# Altium schematic sheet MC3_blocks.SchDoc
size Letter; Organization: Altium Limited; Address1: L3, 12a Rodborough Rd; Address2: Frenchs Forest; Address3: NSW; Address4: Australia 2086; DocumentNumber: D_2; SheetNumber: 2; SheetTotal: 21
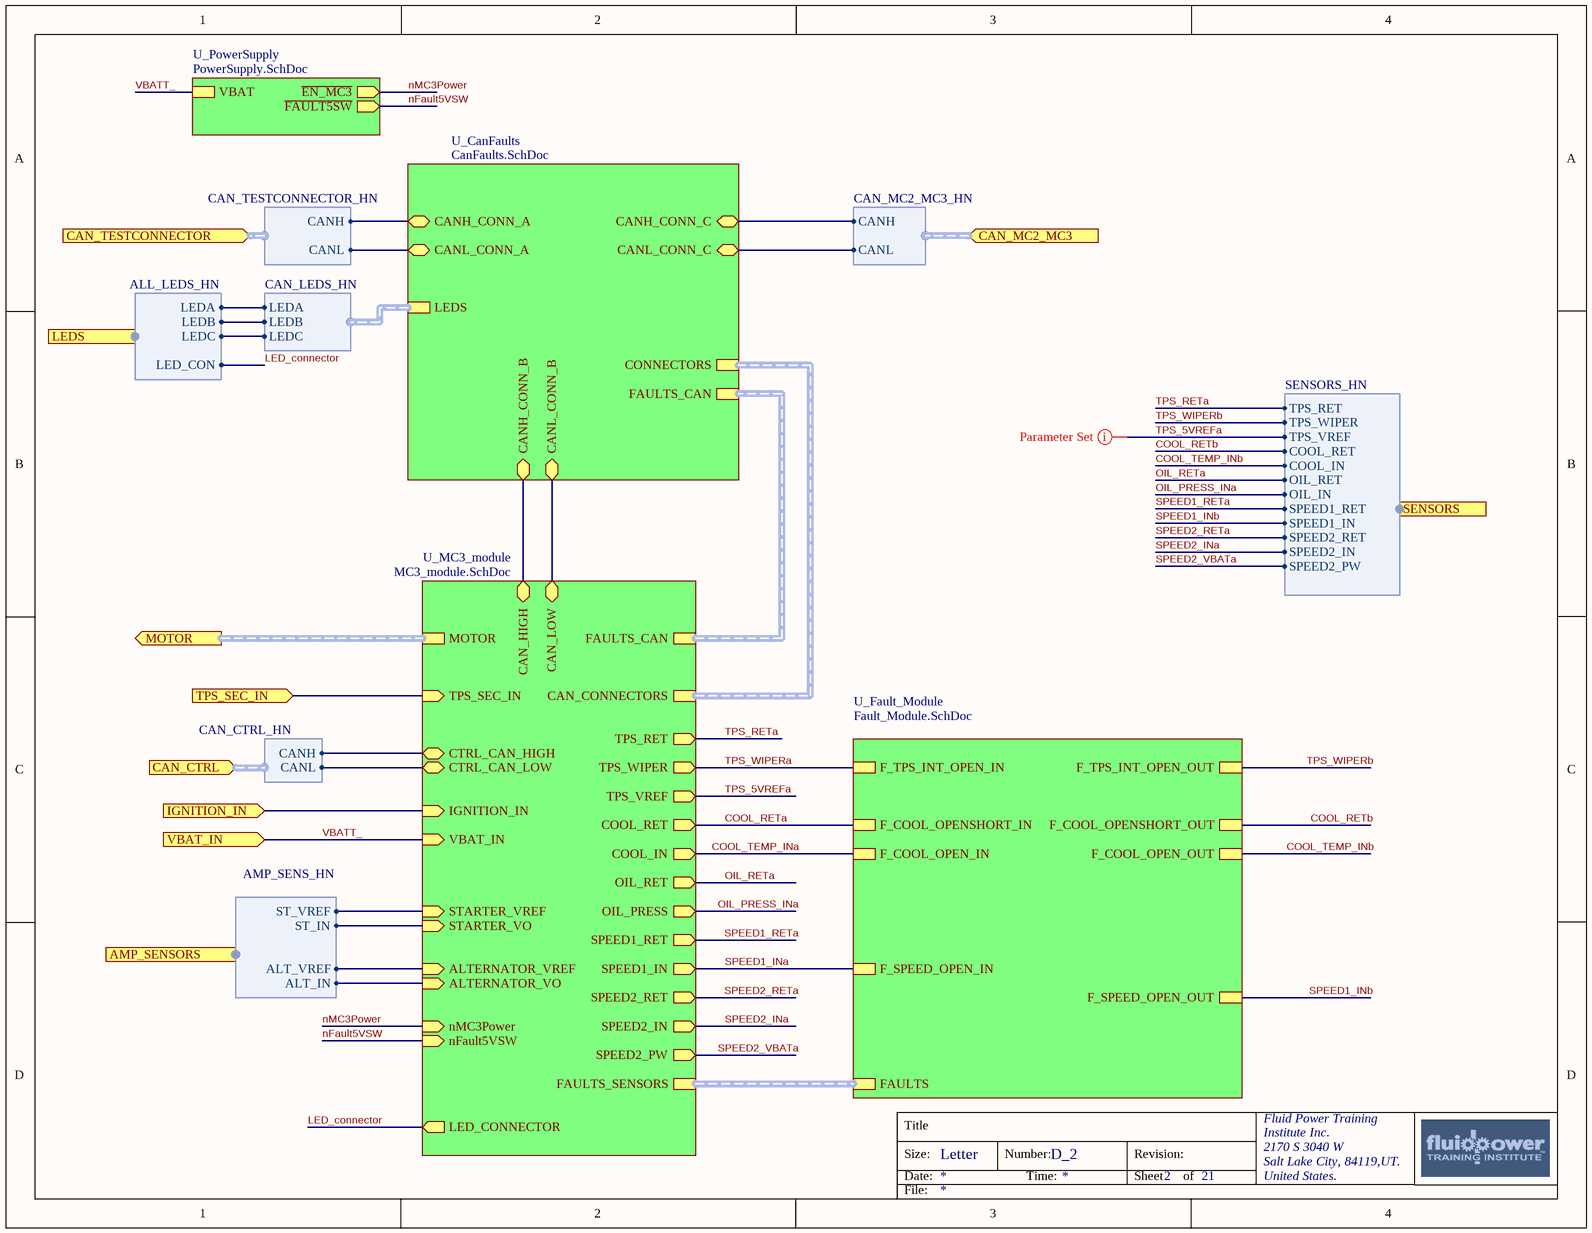
[diagram p0: MC3_blocks.SchDoc]

## Sub-sheets
U_CanFaults = CanFaults.SchDoc: CANH_CONN_A (bidir), CANL_CONN_A (bidir), CANH_CONN_B (bidir), CANL_CONN_B (bidir), CANH_CONN_C (bidir), CANL_CONN_C (bidir), FAULTS_CAN (harness FAULTSCAN_HN), CONNECTORS (harness CONNECTORS_HN), LEDS (harness CAN_LEDS_HN)
U_Fault_Module = Fault_Module.SchDoc: F_SPEED_OPEN_IN, F_SPEED_OPEN_OUT, F_TPS_INT_OPEN_IN, F_TPS_INT_OPEN_OUT, F_COOL_OPEN_IN, F_COOL_OPEN_OUT, F_COOL_OPENSHORT_OUT, F_COOL_OPENSHORT_IN, FAULTS (harness FAULTSSENSORS_HN)
U_MC3_module = MC3_module.SchDoc: STARTER_VREF (in), ALTERNATOR_VREF (in), STARTER_VO (in), ALTERNATOR_VO (in), CAN_HIGH (bidir), CAN_LOW (bidir), IGNITION_IN (in), VBAT_IN (in), SPEED2_PW (out), OIL_PRESS (out), TPS_VREF (out), COOL_IN (out), OIL_RET (out), TPS_RET (out), TPS_WIPER (out), SPEED1_RET (out), SPEED1_IN (out), COOL_RET (out), SPEED2_IN (out), SPEED2_RET (out), CAN_CONNECTORS (harness CONNECTORS_HN), nMC3Power (in), nFault5VSW (in), TPS_SEC_IN (in), CTRL_CAN_HIGH (bidir), CTRL_CAN_LOW (bidir), FAULTS_SENSORS (harness FAULTSSENSORS_HN), FAULTS_CAN (harness FAULTSCAN_HN), LED_CONNECTOR (out), MOTOR (harness MOTORPW_HN)
U_PowerSupply = PowerSupply.SchDoc: VBAT, ~{EN_MC3} (out), ~{FAULT5SW} (out)

## Ports
AMP_SENSORS (out, harness AMP_SENS_HN), CAN_CTRL (in, harness CAN_CTRL_HN), CAN_MC2_MC3 (in, harness CAN_MC2_MC3_HN), CAN_TESTCONNECTOR (in, harness CAN_TESTCONNECTOR_HN), IGNITION_IN (in), LEDS (out, harness ALL_LEDS_HN), MOTOR (out, harness MOTORPW_HN), SENSORS (in, harness SENSORS_HN), TPS_SEC_IN (in), VBAT_IN (in)

## Harnesses
SENSORS_HN: TPS_RET, TPS_WIPER, TPS_VREF, COOL_RET, COOL_IN, OIL_RET, OIL_IN, SPEED1_RET, SPEED1_IN, SPEED2_RET, SPEED2_IN, SPEED2_PW
CAN_TESTCONNECTOR_HN: CANH, CANL
CAN_MC2_MC3_HN: CANH, CANL
CAN_CTRL_HN: CANH, CANL
CAN_LEDS_HN: LEDA, LEDB, LEDC
ALL_LEDS_HN: LEDA, LEDB, LEDC, LED_CON
AMP_SENS_HN: ST_VREF, ST_IN, ALT_VREF, ALT_IN

## Nets
COOL_RETa: sheet U_MC3_module/COOL_RET, sheet U_Fault_Module/F_COOL_OPENSHORT_IN
COOL_RETb: sheet U_Fault_Module/F_COOL_OPENSHORT_OUT, port SENSORS.COOL_RET
COOL_TEMP_INa: sheet U_MC3_module/COOL_IN, sheet U_Fault_Module/F_COOL_OPEN_IN
COOL_TEMP_INb: sheet U_Fault_Module/F_COOL_OPEN_OUT, port SENSORS.COOL_IN
IGNITION_IN: port IGNITION_IN, sheet U_MC3_module/IGNITION_IN
LED_connector: sheet U_MC3_module/LED_CONNECTOR, port LEDS.LED_CON
nFault5VSW: sheet U_MC3_module/nFault5VSW, sheet U_PowerSupply/~{FAULT5SW}
nMC3Power: sheet U_MC3_module/nMC3Power, sheet U_PowerSupply/~{EN_MC3}
OIL_PRESS_INa: sheet U_MC3_module/OIL_PRESS, port SENSORS.OIL_IN
OIL_RETa: sheet U_MC3_module/OIL_RET, port SENSORS.OIL_RET
SPEED1_INa: sheet U_MC3_module/SPEED1_IN, sheet U_Fault_Module/F_SPEED_OPEN_IN
SPEED1_INb: sheet U_Fault_Module/F_SPEED_OPEN_OUT, port SENSORS.SPEED1_IN
SPEED1_RETa: sheet U_MC3_module/SPEED1_RET, port SENSORS.SPEED1_RET
SPEED2_INa: sheet U_MC3_module/SPEED2_IN, port SENSORS.SPEED2_IN
SPEED2_RETa: sheet U_MC3_module/SPEED2_RET, port SENSORS.SPEED2_RET
SPEED2_VBATa: sheet U_MC3_module/SPEED2_PW, port SENSORS.SPEED2_PW
TPS_5VREFa: sheet U_MC3_module/TPS_VREF, port SENSORS.TPS_VREF
TPS_RETa: sheet U_MC3_module/TPS_RET, port SENSORS.TPS_RET
TPS_SEC_IN: port TPS_SEC_IN, sheet U_MC3_module/TPS_SEC_IN
TPS_WIPERa: sheet U_MC3_module/TPS_WIPER, sheet U_Fault_Module/F_TPS_INT_OPEN_IN
TPS_WIPERb: sheet U_Fault_Module/F_TPS_INT_OPEN_OUT, port SENSORS.TPS_WIPER
VBATT_: port VBAT_IN, sheet U_MC3_module/VBAT_IN, sheet U_PowerSupply/VBAT
(unnamed): sheet U_MC3_module/STARTER_VREF, port AMP_SENSORS.ST_VREF
(unnamed): sheet U_MC3_module/ALTERNATOR_VREF, port AMP_SENSORS.ALT_VREF
(unnamed): sheet U_MC3_module/STARTER_VO, port AMP_SENSORS.ST_IN
(unnamed): sheet U_MC3_module/ALTERNATOR_VO, port AMP_SENSORS.ALT_IN
(unnamed): sheet U_MC3_module/CAN_HIGH, sheet U_CanFaults/CANH_CONN_B
(unnamed): sheet U_MC3_module/CAN_LOW, sheet U_CanFaults/CANL_CONN_B
(unnamed): sheet U_MC3_module/CTRL_CAN_HIGH, port CAN_CTRL.CANH
(unnamed): sheet U_MC3_module/CTRL_CAN_LOW, port CAN_CTRL.CANL
(unnamed): sheet U_CanFaults/CANH_CONN_A, port CAN_TESTCONNECTOR.CANH
(unnamed): sheet U_CanFaults/CANL_CONN_A, port CAN_TESTCONNECTOR.CANL
(unnamed): sheet U_CanFaults/CANH_CONN_C, port CAN_MC2_MC3.CANH
(unnamed): sheet U_CanFaults/CANL_CONN_C, port CAN_MC2_MC3.CANL
(unnamed): sheet U_CanFaults/LEDS.LEDA, port LEDS.LEDA
(unnamed): sheet U_CanFaults/LEDS.LEDB, port LEDS.LEDB
(unnamed): sheet U_CanFaults/LEDS.LEDC, port LEDS.LEDC

## Buses and harness runs
harness port MOTOR = sheet U_MC3_module/MOTOR
harness sheet U_CanFaults/CONNECTORS = sheet U_MC3_module/CAN_CONNECTORS
harness sheet U_CanFaults/FAULTS_CAN = sheet U_MC3_module/FAULTS_CAN
harness sheet U_Fault_Module/FAULTS = sheet U_MC3_module/FAULTS_SENSORS

## Layout directives
net class VREF: TPS_5VREFa

## Notes on the sheet
- Title
- Size:
- Date:
- Letter
- Number:
- Time:
- Revision:
- Sheet
- of
- Fluid Power Training
- Institute Inc.
- 2170 S 3040 W
- Salt Lake City, 84119,UT.
- United States.
- File: